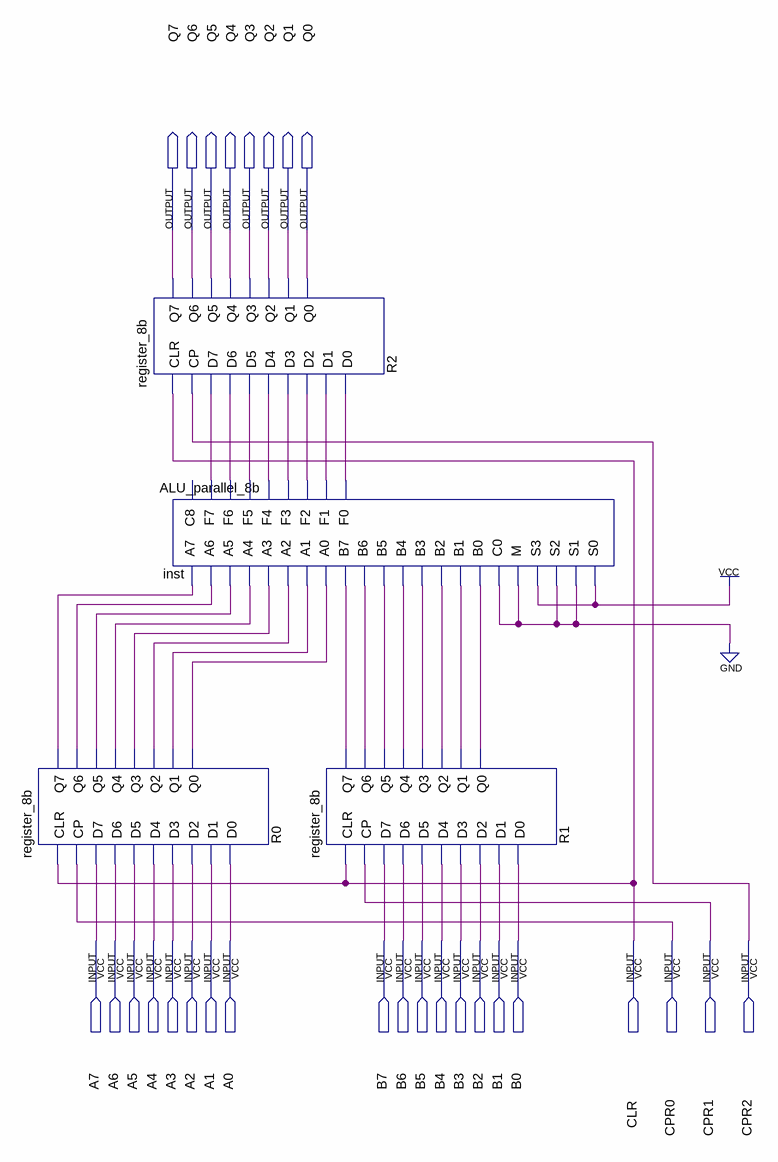
[diagram p0: schematic sheet]
// Quartus schematic ALU_3_in_1.bdf as structural Verilog: 4 symbols, 28 pins
module ALU_3_in_1 (
  input  A7,
  input  A6,
  input  A5,
  input  A4,
  input  A3,
  input  A2,
  input  A1,
  input  A0,
  input  B7,
  input  B6,
  input  B5,
  input  B4,
  input  B3,
  input  B2,
  input  B1,
  input  B0,
  input  CLR,
  input  CPR0,
  input  CPR1,
  input  CPR2,
  output Q7,
  output Q6,
  output Q5,
  output Q4,
  output Q3,
  output Q2,
  output Q1,
  output Q0
);

  wire inst_f0, inst_f1, inst_f2, inst_f3, inst_f4, inst_f5, inst_f6, inst_f7, R0_q0, R0_q1, R0_q2, R0_q3,
       R0_q4, R0_q5, R0_q6, R0_q7, R1_q0, R1_q1, R1_q2, R1_q3, R1_q4, R1_q5, R1_q6, R1_q7;

  register_8b R0 (
    .CLR(CLR), .CP(CPR0), .D7(A7), .D6(A6), .D5(A5), .D4(A4), .D3(A3), .D2(A2), .D1(A1), .D0(A0), .Q7(R0_q7),
    .Q6(R0_q6), .Q5(R0_q5), .Q4(R0_q4), .Q3(R0_q3), .Q2(R0_q2), .Q1(R0_q1), .Q0(R0_q0));
  register_8b R2 (
    .CLR(CLR), .CP(CPR2), .D7(inst_f7), .D6(inst_f6), .D5(inst_f5), .D4(inst_f4), .D3(inst_f3), .D2(inst_f2),
    .D1(inst_f1), .D0(inst_f0), .Q7(Q7), .Q6(Q6), .Q5(Q5), .Q4(Q4), .Q3(Q3), .Q2(Q2), .Q1(Q1), .Q0(Q0));
  ALU_parallel_8b inst (
    .A0(R0_q0), .B0(R1_q0), .A1(R0_q1), .B1(R1_q1), .A2(R0_q2), .B2(R1_q2), .A3(R0_q3), .B3(R1_q3),
    .C0(1'b0), .M(1'b0), .S3(1'b1), .S2(1'b0), .S1(1'b0), .S0(1'b1), .A4(R0_q4), .B4(R1_q4), .A5(R0_q5),
    .B5(R1_q5), .A6(R0_q6), .B6(R1_q6), .A7(R0_q7), .B7(R1_q7), .F0(inst_f0), .F1(inst_f1), .F2(inst_f2),
    .F3(inst_f3), .F4(inst_f4), .F5(inst_f5), .F6(inst_f6), .F7(inst_f7));  // open: C8
  register_8b R1 (
    .CLR(CLR), .CP(CPR1), .D7(B7), .D6(B6), .D5(B5), .D4(B4), .D3(B3), .D2(B2), .D1(B1), .D0(B0), .Q7(R1_q7),
    .Q6(R1_q6), .Q5(R1_q5), .Q4(R1_q4), .Q3(R1_q3), .Q2(R1_q2), .Q1(R1_q1), .Q0(R1_q0));
endmodule
